# Altium schematic sheet ad8130.SchDoc
size A4
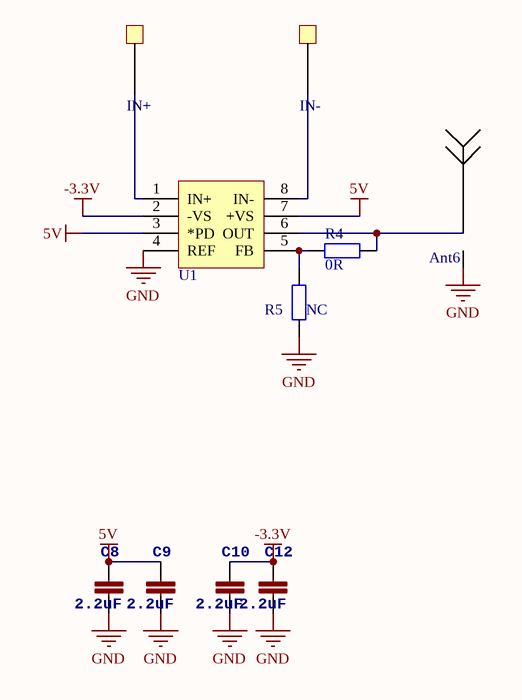
[diagram p0: ad8130.SchDoc]

## Parts
Ant6  Antenna  [SMA-HOLE]  (value not drawn)
C8  2.2uF  [0603]
C9  2.2uF  [0603]
C10  2.2uF  [0603]
C12  2.2uF  [0603]
IN+  TestPad  [TestPad]  (value not drawn)
IN-  TestPad  [TestPad]  (value not drawn)
R4  0R  [0402]
R5  NC  [0402]
U1  AD8130  [SO8]  (value not drawn)

## Nets
5V: C8.2 C9.2 U1.3(*PD) U1.7(+VS)
-3.3V: C10.2 C12.2 U1.2(-VS)
GND: Ant6.GND(G) C8.1 C9.1 C10.1 C12.1 R5.1 U1.4(REF)
NetAnt6_1: Ant6.1 R4.1 U1.6(OUT)
NetIN+_1: IN+.1 U1.1(IN+)
NetIN-_1: IN-.1 U1.8(IN-)
NetR4_2: R4.2 R5.2 U1.5(FB)

## Library data of the parts
C8-C10 C12 = CAP0402-CAP: <b>Capacitor</b> / Standard 0603 ceramic capacitor, and 0.1" leaded capacitor.; PARTNO: CC0402ZRY5V7BB104
R4 R5 = Res2: Resistor; Published: 8-Jun-2000; LatestRevisionDate: 17-Jul-2002; LatestRevisionNote: Re-released for DXP Platform.; PackageReference: AXIAL-0.4; Publisher: Altium Limited; PackageDescription: Axial Device, Thru-Hole; 2 Leads; 0.4 in Pin Spacing